# Altium schematic sheet ILX_Sheet.SchDoc
size A4
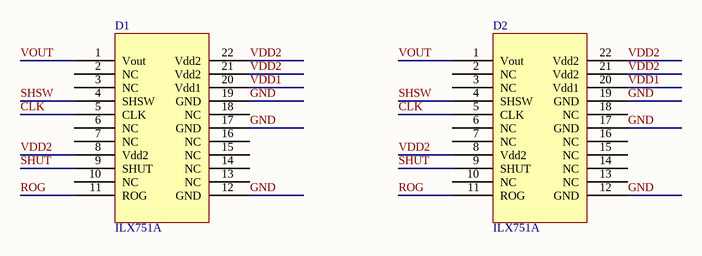
[diagram p0: ILX_Sheet.SchDoc]

## Parts
D1  ILX751A  [ILX751A]
D2  ILX751A  [ILX751A - Module]

## Nets
CLK: D1.5(CLK) D2.5(CLK)
GND: D1.12(GND) D1.17(GND) D1.19(GND) D2.12(GND) D2.17(GND) D2.19(GND)
ROG: D1.11(ROG) D2.11(ROG)
SHSW: D1.4(SHSW) D2.4(SHSW)
SHUT: D1.9(SHUT) D2.9(SHUT)
VDD1: D1.20(Vdd1) D2.20(Vdd1)
VDD2: D1.8(Vdd2) D1.21(Vdd2) D1.22(Vdd2) D2.8(Vdd2) D2.21(Vdd2) D2.22(Vdd2)
VOUT: D1.1(Vout) D2.1(Vout)

Not connected (* = marked no-connect by the designer): D1 2(NC) 3(NC) 6(NC) 7(NC) 10(NC) 13(NC) 14(NC) 15(NC) 16(NC) 18(NC); D2 2(NC) 3(NC) 6(NC) 7(NC) 10(NC) 13(NC) 14(NC) 15(NC) 16(NC) 18(NC)

## Library data of the parts
D2 = ILX751A_module